# Altium schematic sheet Res 56K.schdoc
size 127 x 99 mm
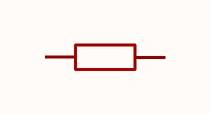
[diagram p0: Res 56K.schdoc]

## Parts
R?  56kΩ  [R0603]  (value not drawn)

## Nets

Not connected (* = marked no-connect by the designer): R? 1 2

## Library data of the parts
R? = ERJ3EKF5602V: Manufacturer: PANASONIC(松下); Add into BOM: yes; Tolerance: ±1%; Temperature Coefficient: ±100ppm/℃; Symbol: ERJ3EKF5602V; Device: ERJ3EKF5602V; LCSC Part Name: 56kΩ ±1% 100mW 厚膜电阻; Supplier Part: C278629; Manufacturer Part: ERJ3EKF5602V; Supplier Footprint: 0603; JLCPCB Part Class: Extended Part; Datasheet: https://atta.szlcsc.com/upload/public/pdf/source/20181114/C278629_181D62B106189050D6A2EF7256E211B4.pdf; Supplier: LCSC; Convert to PCB: yes; Type: Thick Film Resistors; Value: 56kΩ; Overload Voltage (Max): -; Operating Temperature Range: -55℃~+155℃